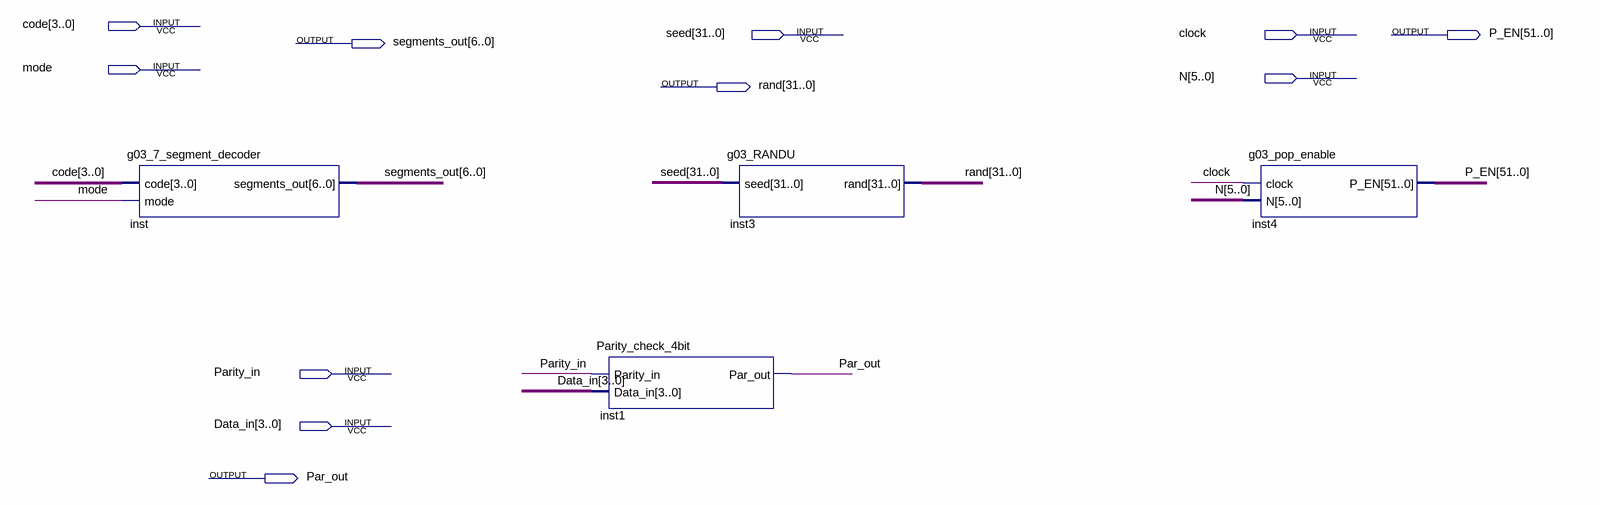
[diagram p0: schematic sheet]
// Quartus schematic g03_lab2.bdf as structural Verilog: 4 symbols, 11 pins
module g03_lab2 (
  input  [3:0] code,
  input  [31:0] seed,
  input  clock,
  input  mode,
  input  [5:0] N,
  input  Parity_in,
  input  [3:0] Data_in,
  output [51:0] P_EN,
  output [6:0] segments_out,
  output [31:0] \rand ,
  output Par_out
);

  g03_7_segment_decoder inst (.code(code), .mode(mode), .segments_out(segments_out));
  Parity_check_4bit inst1 (.Parity_in(Parity_in), .Data_in(Data_in), .Par_out(Par_out));
  g03_RANDU inst3 (.seed(seed), .\rand (\rand ));
  g03_pop_enable inst4 (.clock(clock), .N(N), .P_EN(P_EN));
endmodule
